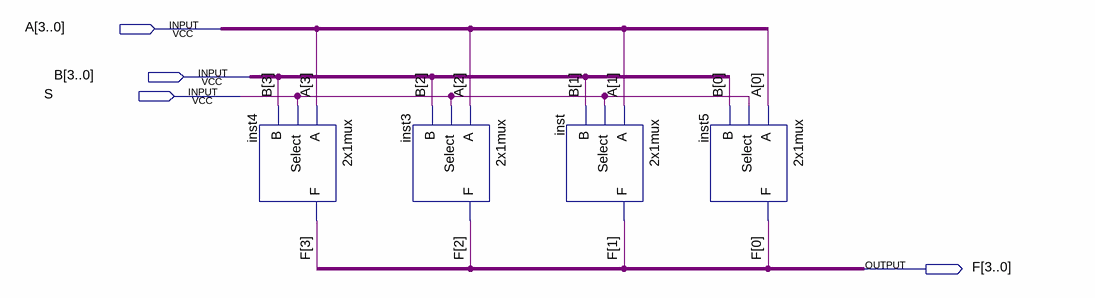
[diagram p0: schematic sheet]
// Quartus schematic 2x1BusMUX.bdf as structural Verilog: 4 symbols, 4 pins
module \2x1BusMUX  (
  input  [3:0] A,
  input  [3:0] B,
  input  S,
  output [3:0] F
);

  \2x1mux  inst4 (.A(A[3]), .Select(S), .B(B[3]), .F(F[3]));
  \2x1mux  inst3 (.A(A[2]), .Select(S), .B(B[2]), .F(F[2]));
  \2x1mux  inst (.A(A[1]), .Select(S), .B(B[1]), .F(F[1]));
  \2x1mux  inst5 (.A(A[0]), .Select(S), .B(B[0]), .F(F[0]));
endmodule
